# Altium project NIXIEClock.PrjPCB
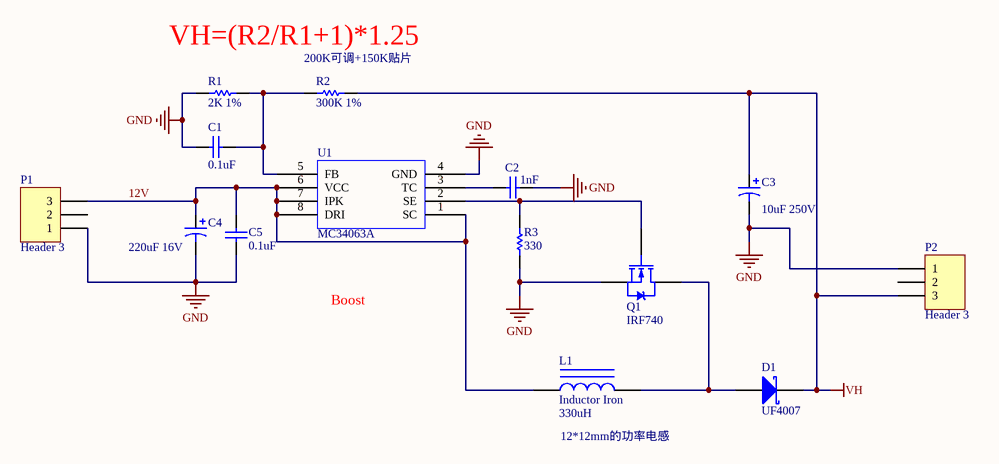
[diagram p0: NIXIEClock_SCH.SchDoc]
1 sheet, 14 parts. Net scope: global (net labels, ports and power ports of the same name join across sheets).
Board file: NIXIEClock_151223.PcbDoc

## Sheet NIXIEClock_SCH.SchDoc
size A4

### Parts
C1  value 0.1uF  [0805]  (hidden comment: Cap Semi)
C2  value 1nF  [0805]  (hidden comment: Cap Semi)
C3  value 10uF 250V  [C-RB-8]  (hidden comment: Cap Pol1)
C4  value 220uF 16V  [C-RB-6]  (hidden comment: Cap Pol1)
C5  value 0.1uF  [0805]  (hidden comment: Cap Semi)
D1  UF4007  [DO-41]
L1  Inductor Iron  value 330uH  [GDRH127]
P1  Header 3  [HDR1X3]
P2  Header 3  [HDR1X3]
Q1  IRF740  [TO-220AB]
R1  value 2K 1%  [0805]  (hidden comment: Res Semi)
R2  value 300K 1%  [0805]  (hidden comment: Res Semi)
R3  value 330  [0805]  (hidden comment: Res Semi)
U1  MC34063A  [SOIC8]

### Nets
GND: C1.2 C2.1 C3.2 C4.2 C5.1 P1.1 P2.1 Q1.3(S) R1.2 R3.2 U1.4(GND)
VH: C3.1 D1.2(K) P2.3 R2.1
12V: C4.1 C5.2 L1.1 P1.3 U1.1(SC) U1.6(VCC) U1.7(IPK) U1.8(DRI)
NetC1_1: C1.1 R1.1 R2.2 U1.5(FB)
NetC2_2: C2.2 U1.3(TC)
NetD1_1: D1.1(A) L1.2 Q1.2(D)
NetQ1_1: Q1.1(G) R3.1 U1.2(SE)

Not connected (* = marked no-connect by the designer): P1 2; P2 2

### Notes on the sheet
- VH=(R2/R1+1)*1.25
- (near R2) 200K可调+150K贴片
- Boost
- (near L1) 12*12mm的功率电感

### Library data of the parts
C1 C2 C5 = Cap Semi: Capacitor (Semiconductor SIM Model); Published: 8-Jun-2000; LatestRevisionDate: 17-Jul-2002; LatestRevisionNote: Re-released for DXP Platform.; PackageReference: C1206; Publisher: Altium Limited
C3 C4 = Cap Pol1: Polarized Capacitor (Radial); Published: 8-Jun-2000; LatestRevisionDate: 17-Jul-2002; LatestRevisionNote: Re-released for DXP Platform.; PackageReference: RB7.6-15; Publisher: Altium Limited; PackageDescription: Polarized Capacitor (Radial); 2 Leads
D1 = D Schottky: Schottky Diode; Published: 8-Jun-2000; LatestRevisionDate: 17-Jul-2002; LatestRevisionNote: Re-released for DXP Platform.; PackageReference: SMB; Publisher: Altium Limited; PackageDescription: DO-214-AA/SMB; 2 C-Bend Leads; Body 5.3 x 3.6 mm, inc. leads (LxW); Code_JEDEC: DO-214-AA
L1 = Inductor Iron: Magnetic-Core Inductor; Published: 24-Mar-1999; LatestRevisionDate: 17-Jul-2002; LatestRevisionNote: Re-released for DXP Platform.; PackageReference: AXIAL-0.9; Publisher: Altium Limited; PackageDescription: Axial Device, Thru-Hole; 2 Leads; 0.9 in Pin Spacing
P1 P2 = Header 3: Header, 3-Pin; LatestRevisionDate: 17-Jul-2002; LatestRevisionNote: Re-released for DXP Platform.; Publisher: Altium Limited
Q1 = NMOS-2: N-Channel Power MOSFET; Note: Pin 2 is electrically connected to pin 4.; Published: 8-Jun-2000; LatestRevisionDate: 17-Jul-2002; LatestRevisionNote: Re-released for DXP Platform.; DatasheetVersion: PD-9.814; PackageVersion: Feb-1997; PackageReference: TO-220AB; Publisher: Altium Limited; PackageDescription: TO, Thru-Hole, Vertical, Heatsink Mounted; 3 In-Line Leads; Pitch 2.54 mm; ComponentLink1Description: Manufacturer Link; ComponentLink1URL: http://www.irf.com/
R1-R3 = Res Semi: Semiconductor Resistor; Published: 8-Jun-2000; LatestRevisionDate: 17-Jul-2002; LatestRevisionNote: Re-released for DXP Platform.; PackageReference: AXIAL-0.5; Publisher: Altium Limited